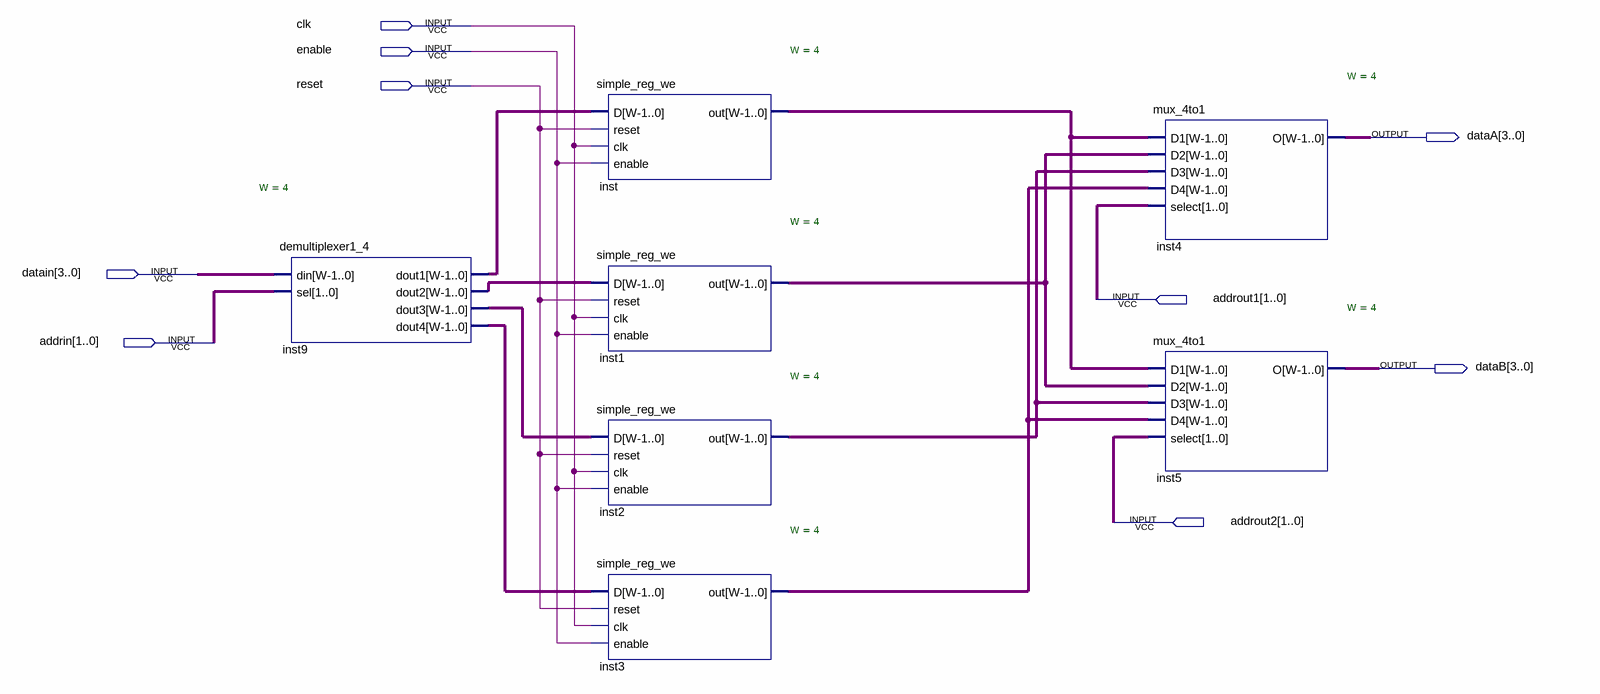
[diagram p0: schematic sheet]
// Quartus schematic registerfile.bdf as structural Verilog: 7 symbols, 9 pins
module registerfile (
  input  clk,
  input  enable,
  input  reset,
  input  [3:0] datain,
  input  [1:0] addrout1,
  input  [1:0] addrin,
  input  [1:0] addrout2,
  output [3:0] dataA,
  output [3:0] dataB
);

  wire [3:0] inst1_out, inst2_out, inst3_out, inst9_dout1, inst9_dout2, inst9_dout3, inst9_dout4, inst_out;

  demultiplexer1_4 #(.W(4)) inst9 (
    .din(datain), .sel(addrin), .dout1(inst9_dout1), .dout2(inst9_dout2), .dout3(inst9_dout3),
    .dout4(inst9_dout4));
  simple_reg_we #(.W(4)) inst (.D(inst9_dout1), .reset(reset), .clk(clk), .enable(enable), .out(inst_out));
  simple_reg_we #(.W(4)) inst1 (.D(inst9_dout2), .reset(reset), .clk(clk), .enable(enable), .out(inst1_out));
  simple_reg_we #(.W(4)) inst2 (.D(inst9_dout3), .reset(reset), .clk(clk), .enable(enable), .out(inst2_out));
  simple_reg_we #(.W(4)) inst3 (.D(inst9_dout4), .reset(reset), .clk(clk), .enable(enable), .out(inst3_out));
  mux_4to1 #(.W(4)) inst4 (.D1(inst_out), .D2(inst1_out), .D3(inst2_out), .D4(inst3_out), .select(addrout1), .O(dataA));
  mux_4to1 #(.W(4)) inst5 (.D1(inst_out), .D2(inst1_out), .D3(inst2_out), .D4(inst3_out), .select(addrout2), .O(dataB));
endmodule
